# Altium schematic sheet E17-04-BMS.SchDoc
size A; DocumentNumber: 1; SheetNumber: 1; SheetTotal: 18
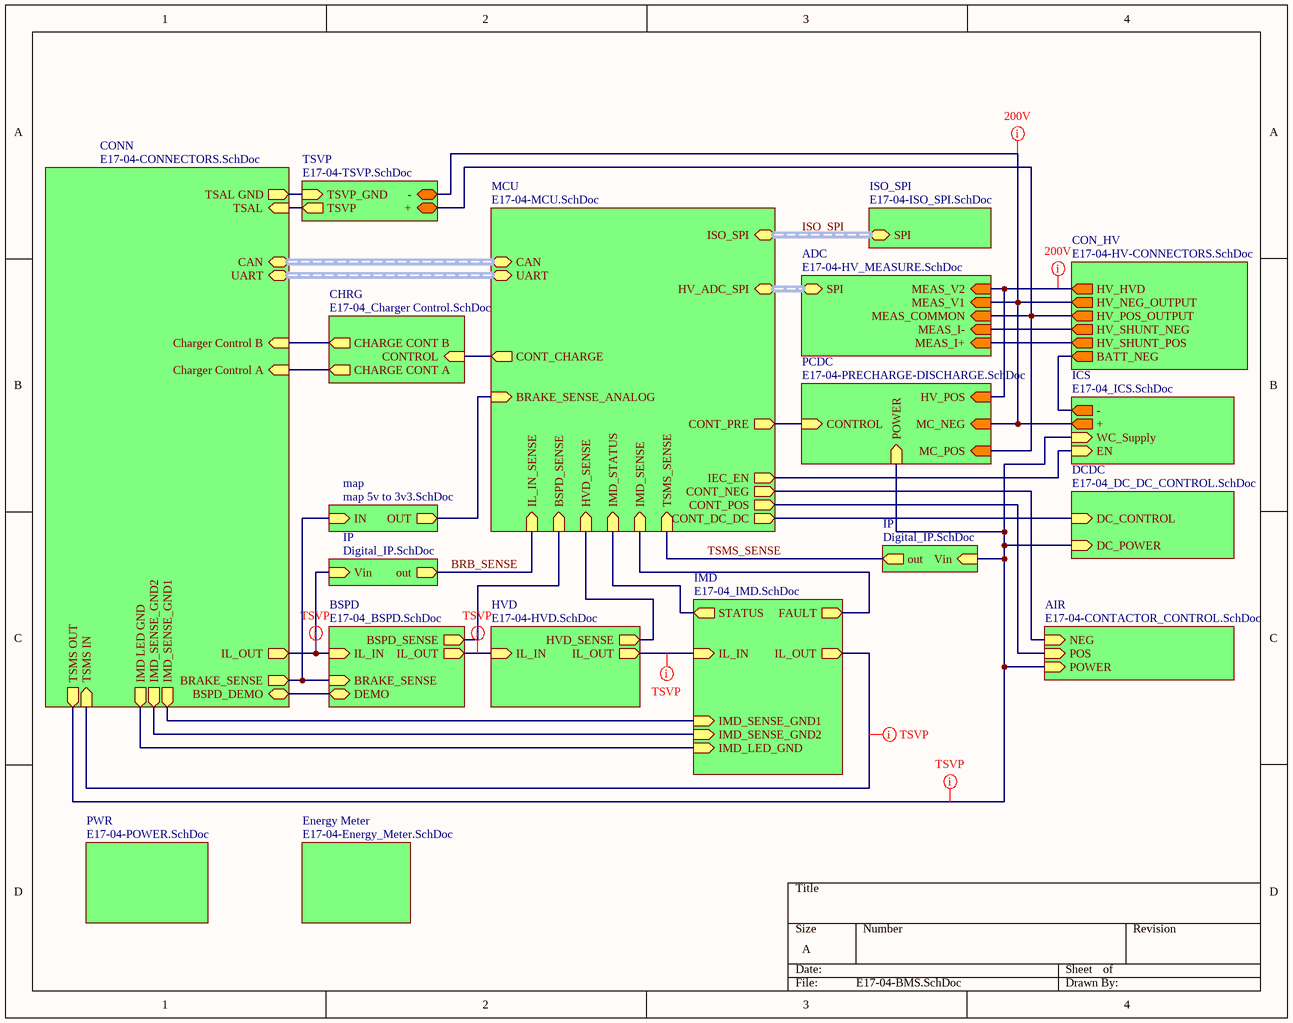
[diagram p0: E17-04-BMS.SchDoc]

## Sub-sheets
ADC = E17-04-HV_MEASURE.SchDoc: MEAS_V1 (in), MEAS_I- (in), MEAS_V2 (in), MEAS_I+ (in), MEAS_COMMON (in), SPI (harness SPI)
AIR = E17-04-CONTACTOR_CONTROL.SchDoc: POWER (in), POS (in), NEG (in)
BSPD = E17-04_BSPD.SchDoc: BRAKE_SENSE (in), IL_IN (in), IL_OUT (out), BSPD_SENSE (out), DEMO (bidir)
CHRG = E17-04_Charger Control.SchDoc: CHARGE CONT A (out), CONTROL (in), CHARGE CONT B (out)
CON_HV = E17-04-HV-CONNECTORS.SchDoc: HV_HVD (out), HV_NEG_OUTPUT (out), HV_POS_OUTPUT (out), HV_SHUNT_NEG (out), HV_SHUNT_POS (out), BATT_NEG (out)
CONN = E17-04-CONNECTORS.SchDoc: IL_OUT (out), BRAKE_SENSE (out), IMD LED GND (out), TSAL GND (out), TSAL (in), IMD_SENSE_GND1 (out), IMD_SENSE_GND2 (out), Charger Control A (in), Charger Control B (in), TSMS IN (in), TSMS OUT (out), CAN (harness CAN), UART (harness UART), BSPD_DEMO (bidir)
DCDC = E17-04_DC_DC_CONTROL.SchDoc: DC_CONTROL (in), DC_POWER (in)
Energy Meter = E17-04-Energy_Meter.SchDoc: no entries
HVD = E17-04-HVD.SchDoc: IL_OUT (out), IL_IN (in), HVD_SENSE (out)
ICS = E17-04_ICS.SchDoc: + (out), - (out), EN (in), WC_Supply (in)
IMD = E17-04_IMD.SchDoc: IL_IN (in), IL_OUT (out), FAULT (out), IMD_LED_GND (in), IMD_SENSE_GND2 (in), IMD_SENSE_GND1 (in), STATUS (out)
IP = Digital_IP.SchDoc: Vin (in), out (out)
IP = Digital_IP.SchDoc: Vin (in), out (out)
ISO_SPI = E17-04-ISO_SPI.SchDoc: SPI (harness SPI)
map = map 5v to 3v3.SchDoc: IN (in), OUT (out)
MCU = E17-04-MCU.SchDoc: IMD_SENSE (in), CONT_POS (out), CONT_PRE (out), CONT_NEG (out), IL_IN_SENSE (in), BSPD_SENSE (in), HVD_SENSE (in), TSMS_SENSE (in), CONT_CHARGE (out), IMD_STATUS (in), IEC_EN (out), CAN (harness CAN), HV_ADC_SPI (harness SPI), ISO_SPI (harness SPI), UART (harness UART), BRAKE_SENSE_ANALOG (in), CONT_DC_DC (out)
PCDC = E17-04-PRECHARGE-DISCHARGE.SchDoc: HV_POS (in), MC_POS (in), MC_NEG (in), CONTROL (in), POWER (in)
PWR = E17-04-POWER.SchDoc: no entries
TSVP = E17-04-TSVP.SchDoc: TSVP (out), TSVP_GND (in), -, +

## Nets
BRB_SENSE: sheet MCU/IL_IN_SENSE, sheet IP/out
TSMS_SENSE: sheet MCU/TSMS_SENSE, sheet IP/out
(unnamed): sheet CONN/IL_OUT, sheet BSPD/IL_IN, sheet IP/Vin
(unnamed): sheet CONN/BRAKE_SENSE, sheet BSPD/BRAKE_SENSE, sheet map/IN
(unnamed): sheet CONN/IMD LED GND, sheet IMD/IMD_LED_GND
(unnamed): sheet CONN/TSAL GND, sheet TSVP/TSVP_GND
(unnamed): sheet CONN/TSAL, sheet TSVP/TSVP
(unnamed): sheet CONN/IMD_SENSE_GND1, sheet IMD/IMD_SENSE_GND1
(unnamed): sheet CONN/IMD_SENSE_GND2, sheet IMD/IMD_SENSE_GND2
(unnamed): sheet CONN/Charger Control A, sheet CHRG/CHARGE CONT A
(unnamed): sheet CONN/Charger Control B, sheet CHRG/CHARGE CONT B
(unnamed): sheet CONN/TSMS IN, sheet IMD/IL_OUT
(unnamed): sheet CONN/TSMS OUT, sheet PCDC/POWER, sheet AIR/POWER, sheet ICS/WC_Supply, sheet IP/Vin, sheet DCDC/DC_POWER
(unnamed): sheet CONN/BSPD_DEMO, sheet BSPD/DEMO
(unnamed): sheet BSPD/IL_OUT, sheet HVD/IL_IN
(unnamed): sheet BSPD/BSPD_SENSE, sheet MCU/BSPD_SENSE
(unnamed): sheet IMD/IL_IN, sheet HVD/IL_OUT
(unnamed): sheet IMD/FAULT, sheet MCU/IMD_SENSE
(unnamed): sheet IMD/STATUS, sheet MCU/IMD_STATUS
(unnamed): sheet PCDC/HV_POS, sheet ADC/MEAS_V2, sheet CON_HV/HV_HVD
(unnamed): sheet PCDC/MC_POS, sheet TSVP/+, sheet ADC/MEAS_COMMON, sheet CON_HV/HV_POS_OUTPUT
(unnamed): sheet PCDC/MC_NEG, sheet TSVP/-, sheet ADC/MEAS_V1, sheet CON_HV/HV_NEG_OUTPUT, sheet ICS/+
(unnamed): sheet PCDC/CONTROL, sheet MCU/CONT_PRE
(unnamed): sheet AIR/POS, sheet MCU/CONT_POS
(unnamed): sheet AIR/NEG, sheet MCU/CONT_NEG
(unnamed): sheet MCU/HVD_SENSE, sheet HVD/HVD_SENSE
(unnamed): sheet MCU/CONT_CHARGE, sheet CHRG/CONTROL
(unnamed): sheet MCU/IEC_EN, sheet ICS/EN
(unnamed): sheet MCU/BRAKE_SENSE_ANALOG, sheet map/OUT
(unnamed): sheet MCU/CONT_DC_DC, sheet DCDC/DC_CONTROL
(unnamed): sheet ADC/MEAS_I-, sheet CON_HV/HV_SHUNT_NEG
(unnamed): sheet ADC/MEAS_I+, sheet CON_HV/HV_SHUNT_POS
(unnamed): sheet CON_HV/BATT_NEG, sheet ICS/-

## Buses and harness runs
harness ISO_SPI = sheet ISO_SPI/SPI = sheet MCU/ISO_SPI
harness sheet ADC/SPI = sheet MCU/HV_ADC_SPI
harness sheet CONN/CAN = sheet MCU/CAN
harness sheet CONN/UART = sheet MCU/UART

## Layout directives
rule Clearance Constraint [Generic clearance = 0.4mm, and 3 value(s) for objects]: (no net found under the mark)
rule Undefined; rule Width Constraint [Pref Width = 25mil    Min Width = 20mil    Max Width = 30mil]: (no net found under the mark)